# Altium project APP_1_rene0901.PrjPcb (part 2 of 2)

## Sheet APP_1_ADC.SchDoc
size Tabloid; SheetNumber: 11; SheetTotal: 11; Sheet_Name: ADC; Size: 11x17
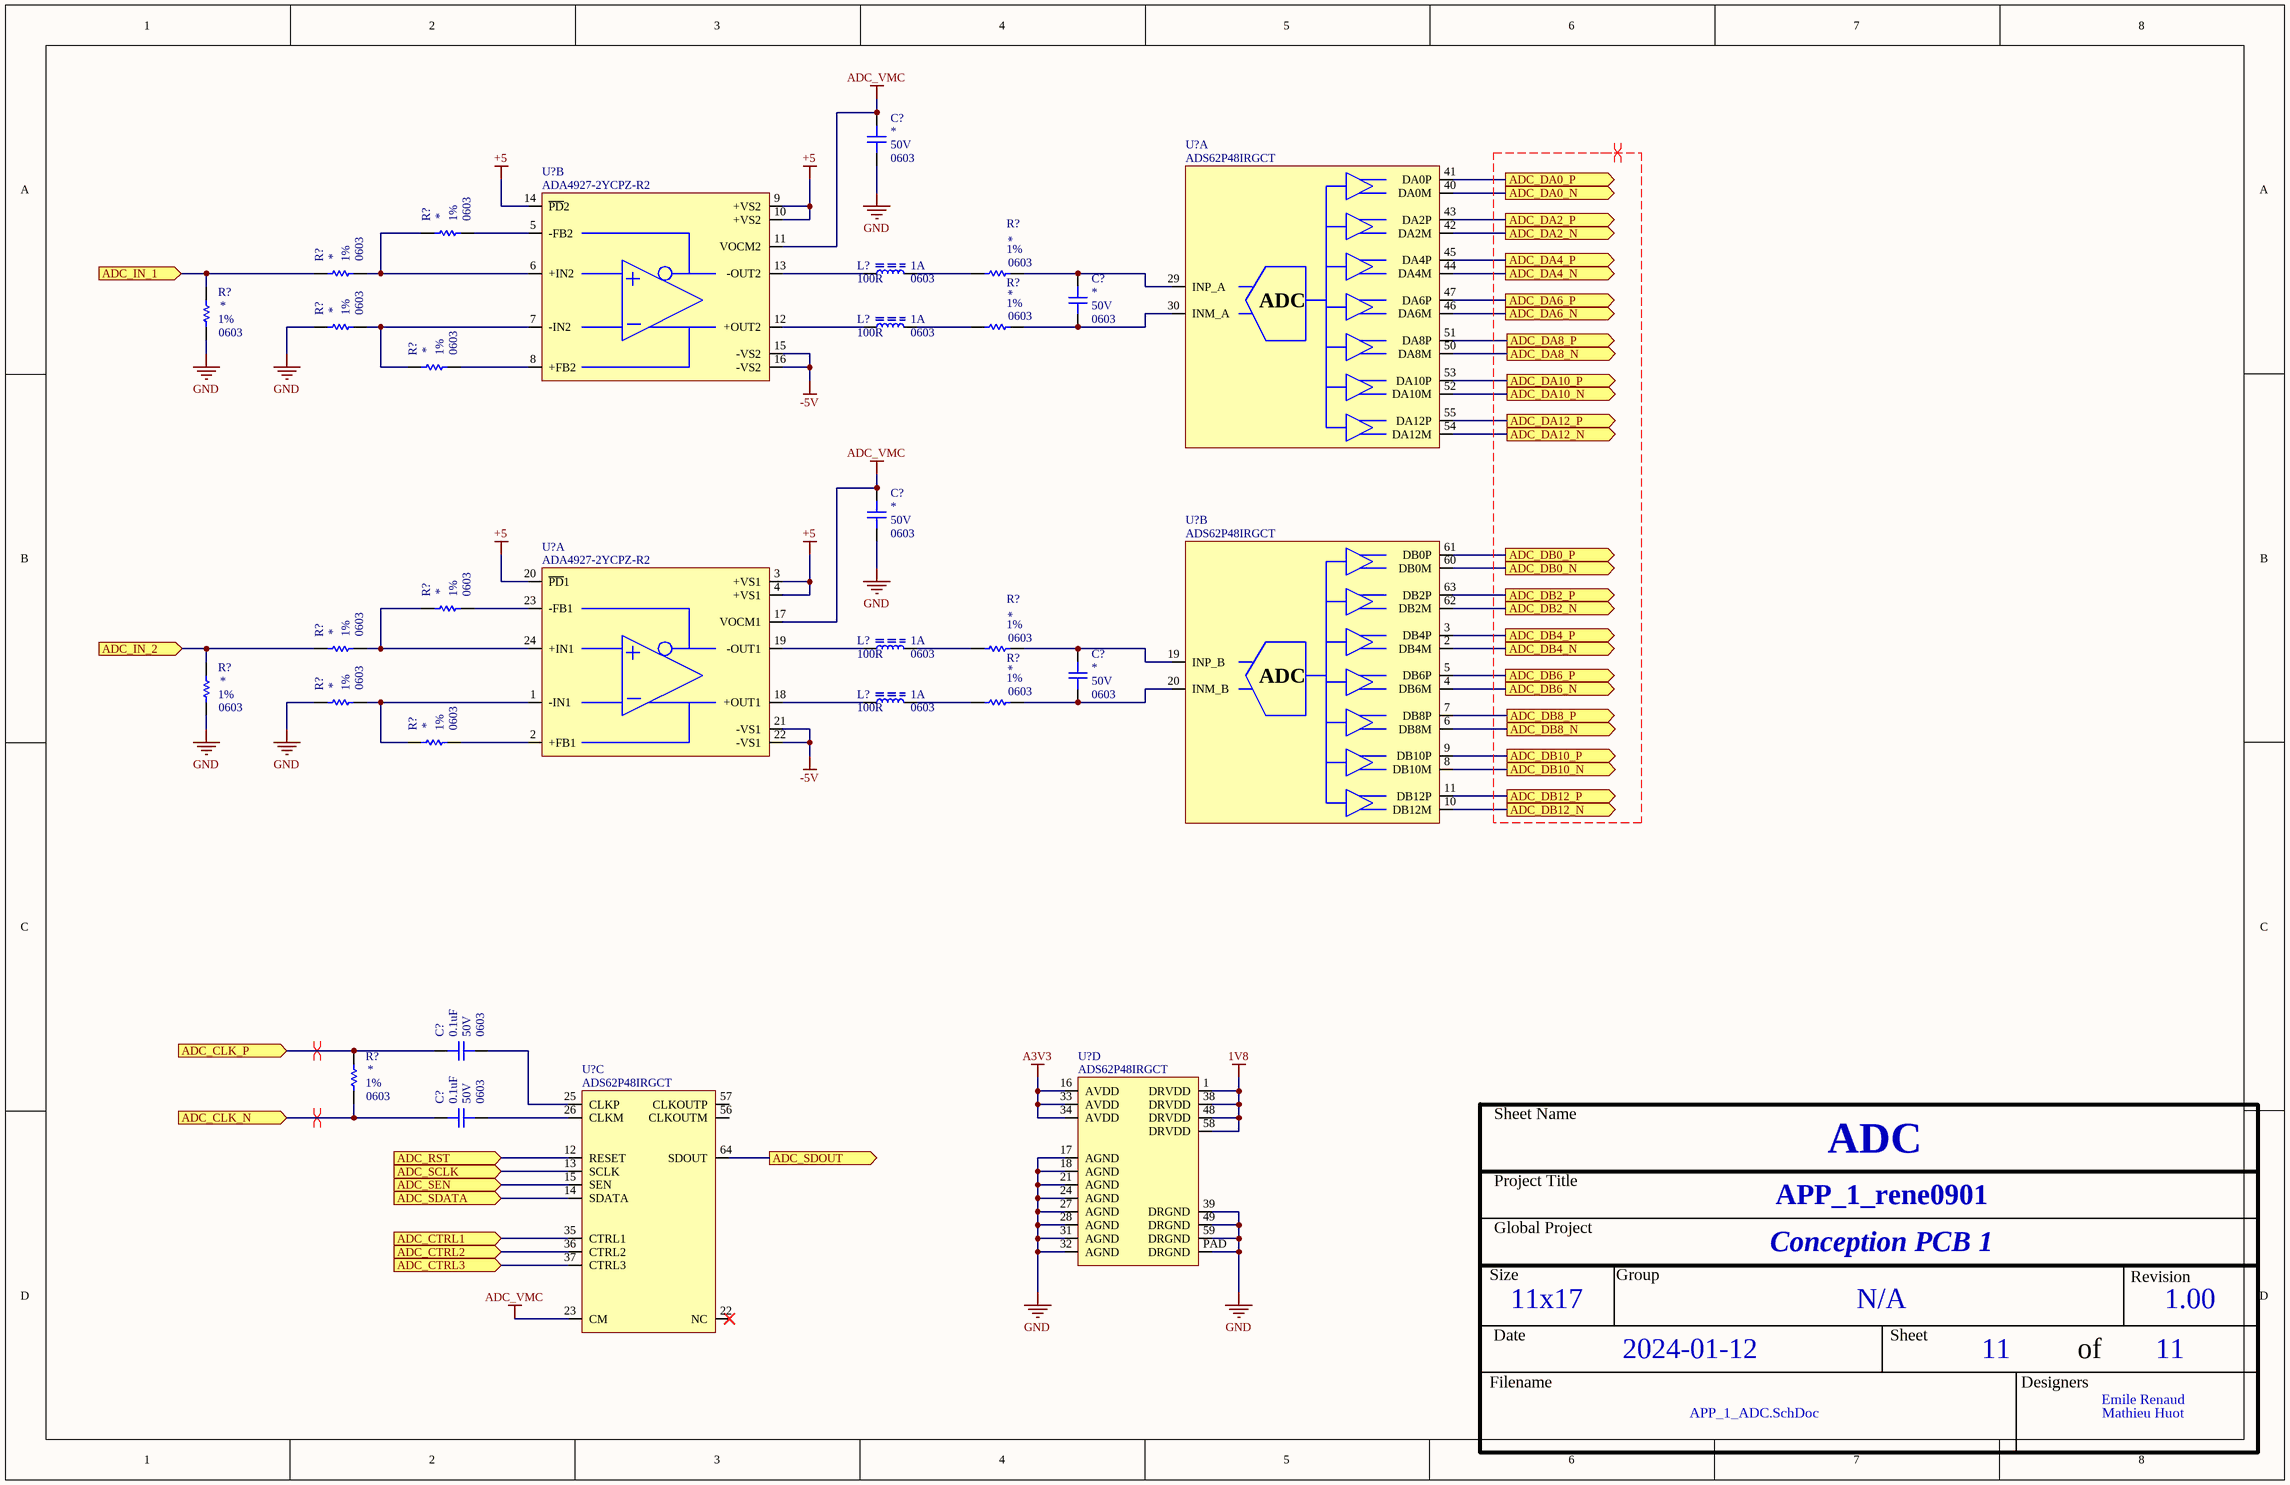
[diagram p7: APP_1_ADC.SchDoc]

### Parts
(Parts that share a designator on the sheet are numbered #1, #2 ... from top to bottom, then left to right.)
C?#43  Voltage: 50V  Package: 0603  [CAP_0603]  (hidden comment: CAP - 0603)
C?#44  Voltage: 50V  Package: 0603  [CAP_0603]  (hidden comment: CAP - 0603)
C?#45  Voltage: 50V  Package: 0603  [CAP_0603]  (hidden comment: CAP - 0603)
C?#46  Voltage: 50V  Package: 0603  [CAP_0603]  (hidden comment: CAP - 0603)
C?#47  value 0.1uF  Voltage: 50V  Package: 0603  [CAP_0603]  (hidden comment: CAP - 0603)
C?#48  value 0.1uF  Voltage: 50V  Package: 0603  [CAP_0603]  (hidden comment: CAP - 0603)
L?#6  value 100R  Current: 1A  Package: 0603  [FER_0603]  (hidden comment: FER - 0603)
L?#7  value 100R  Current: 1A  Package: 0603  [FER_0603]  (hidden comment: FER - 0603)
L?#8  value 100R  Current: 1A  Package: 0603  [FER_0603]  (hidden comment: FER - 0603)
L?#9  value 100R  Current: 1A  Package: 0603  [FER_0603]  (hidden comment: FER - 0603)
R?#62  Package: 0603  Precision: 1%  [RES_0603]  (hidden comment: RES - 0603)
R?#63  Package: 0603  Precision: 1%  [RES_0603]  (hidden comment: RES - 0603)
R?#64  Package: 0603  Precision: 1%  [RES_0603]  (hidden comment: RES - 0603)
R?#65  Package: 0603  Precision: 1%  [RES_0603]  (hidden comment: RES - 0603)
R?#66  Package: 0603  Precision: 1%  [RES_0603]  (hidden comment: RES - 0603)
R?#67  Package: 0603  Precision: 1%  [RES_0603]  (hidden comment: RES - 0603)
R?#68  Package: 0603  Precision: 1%  [RES_0603]  (hidden comment: RES - 0603)
R?#69  Package: 0603  Precision: 1%  [RES_0603]  (hidden comment: RES - 0603)
R?#70  Package: 0603  Precision: 1%  [RES_0603]  (hidden comment: RES - 0603)
R?#71  Package: 0603  Precision: 1%  [RES_0603]  (hidden comment: RES - 0603)
R?#72  Package: 0603  Precision: 1%  [RES_0603]  (hidden comment: RES - 0603)
R?#73  Package: 0603  Precision: 1%  [RES_0603]  (hidden comment: RES - 0603)
R?#74  Package: 0603  Precision: 1%  [RES_0603]  (hidden comment: RES - 0603)
R?#75  Package: 0603  Precision: 1%  [RES_0603]  (hidden comment: RES - 0603)
R?#76  Package: 0603  Precision: 1%  [RES_0603]  (hidden comment: RES - 0603)
U?#17  ADS62P48IRGCT  [ADC_ADS62P48IRGCT]  (part A of 4)
U?#18  ADA4927-2YCPZ-R2  [OPAMP_ADA4927-2YCPZ-R2]  (part B of 2)
U?#19  ADS62P48IRGCT  [ADC_ADS62P48IRGCT]  (part B of 4)
U?#20  ADA4927-2YCPZ-R2  [OPAMP_ADA4927-2YCPZ-R2]  (part A of 2)
U?#21  ADS62P48IRGCT  [ADC_ADS62P48IRGCT]  (part D of 4)
U?#22  ADS62P48IRGCT  [ADC_ADS62P48IRGCT]  (part C of 4)

### Ports
ADC_CLK_N (in), ADC_CLK_P (in), ADC_CTRL1 (in), ADC_CTRL2 (in), ADC_CTRL3 (in), ADC_DA0_N (out), ADC_DA0_P (out), ADC_DA2_N (out), ADC_DA2_P (out), ADC_DA4_N (out), ADC_DA4_P (out), ADC_DA6_N (out), ADC_DA6_P (out), ADC_DA8_N (out), ADC_DA8_P (out), ADC_DA10_N (out), ADC_DA10_P (out), ADC_DA12_N (out), ADC_DA12_P (out), ADC_DB0_N (out), ADC_DB0_P (out), ADC_DB2_N (out), ADC_DB2_P (out), ADC_DB4_N (out), ADC_DB4_P (out), ADC_DB6_N (out), ADC_DB6_P (out), ADC_DB8_N (out), ADC_DB8_P (out), ADC_DB10_N (out), ADC_DB10_P (out), ADC_DB12_N (out), ADC_DB12_P (out), ADC_IN_1 (in, see APP_1_Connectors_e[2C]), ADC_IN_2 (in, see APP_1_Connectors_e[2D]), ADC_RST (in), ADC_SCLK (in), ADC_SDATA (in), ADC_SDOUT (out), ADC_SEN (in)

### Nets
1V8: U?#21.1(DRVDD) U?#21.38(DRVDD) U?#21.48(DRVDD) U?#21.58(DRVDD)
+5: U?#18.9(+VS2) U?#18.10(+VS2) U?#18.14(~{PD}2) U?#20.3(+VS1) U?#20.4(+VS1) U?#20.20(~{PD}1)
-5V: U?#18.15(-VS2) U?#18.16(-VS2) U?#20.21(-VS1) U?#20.22(-VS1)
A3V3: U?#21.16(AVDD) U?#21.33(AVDD) U?#21.34(AVDD)
ADC_VMC: C?#43.2 C?#45.2 U?#18.11(VOCM2) U?#20.17(VOCM1) U?#22.23(CM)
GND: C?#43.1 C?#45.1 R?#65.1 R?#66.2 R?#72.1 R?#73.2 U?#21.17(AGND) U?#21.18(AGND) U?#21.21(AGND) U?#21.24(AGND) U?#21.27(AGND) U?#21.28(AGND) U?#21.31(AGND) U?#21.32(AGND) U?#21.39(DRGND) U?#21.49(DRGND) U?#21.59(DRGND) U?#21.PAD(DRGND)
ADC_CLK_N: C?#48.2 R?#76.1 ; port ADC_CLK_N
ADC_CLK_P: C?#47.2 R?#76.2 ; port ADC_CLK_P
ADC_CTRL1: U?#22.35(CTRL1) ; port ADC_CTRL1
ADC_CTRL2: U?#22.36(CTRL2) ; port ADC_CTRL2
ADC_CTRL3: U?#22.37(CTRL3) ; port ADC_CTRL3
ADC_DA0_N: U?#17.40(DA0M) ; port ADC_DA0_N
ADC_DA0_P: U?#17.41(DA0P) ; port ADC_DA0_P
ADC_DA2_N: U?#17.42(DA2M) ; port ADC_DA2_N
ADC_DA2_P: U?#17.43(DA2P) ; port ADC_DA2_P
ADC_DA4_N: U?#17.44(DA4M) ; port ADC_DA4_N
ADC_DA4_P: U?#17.45(DA4P) ; port ADC_DA4_P
ADC_DA6_N: U?#17.46(DA6M) ; port ADC_DA6_N
ADC_DA6_P: U?#17.47(DA6P) ; port ADC_DA6_P
ADC_DA8_N: U?#17.50(DA8M) ; port ADC_DA8_N
ADC_DA8_P: U?#17.51(DA8P) ; port ADC_DA8_P
ADC_DA10_N: U?#17.52(DA10M) ; port ADC_DA10_N
ADC_DA10_P: U?#17.53(DA10P) ; port ADC_DA10_P
ADC_DA12_N: U?#17.54(DA12M) ; port ADC_DA12_N
ADC_DA12_P: U?#17.55(DA12P) ; port ADC_DA12_P
ADC_DB0_N: U?#19.60(DB0M) ; port ADC_DB0_N
ADC_DB0_P: U?#19.61(DB0P) ; port ADC_DB0_P
ADC_DB2_N: U?#19.62(DB2M) ; port ADC_DB2_N
ADC_DB2_P: U?#19.63(DB2P) ; port ADC_DB2_P
ADC_DB4_N: U?#19.2(DB4M) ; port ADC_DB4_N
ADC_DB4_P: U?#19.3(DB4P) ; port ADC_DB4_P
ADC_DB6_N: U?#19.4(DB6M) ; port ADC_DB6_N
ADC_DB6_P: U?#19.5(DB6P) ; port ADC_DB6_P
ADC_DB8_N: U?#19.6(DB8M) ; port ADC_DB8_N
ADC_DB8_P: U?#19.7(DB8P) ; port ADC_DB8_P
ADC_DB10_N: U?#19.8(DB10M) ; port ADC_DB10_N
ADC_DB10_P: U?#19.9(DB10P) ; port ADC_DB10_P
ADC_DB12_N: U?#19.10(DB12M) ; port ADC_DB12_N
ADC_DB12_P: U?#19.11(DB12P) ; port ADC_DB12_P
ADC_IN_1: R?#63.2 R?#65.2 ; port ADC_IN_1
ADC_IN_2: R?#70.2 R?#72.2 ; port ADC_IN_2
ADC_RST: U?#22.12(RESET) ; port ADC_RST
ADC_SCLK: U?#22.13(SCLK) ; port ADC_SCLK
ADC_SDATA: U?#22.14(SDATA) ; port ADC_SDATA
ADC_SDOUT: U?#22.64(SDOUT) ; port ADC_SDOUT
ADC_SEN: U?#22.15(SEN) ; port ADC_SEN
NetC?#44_1: C?#44.1 R?#67.1 U?#17.30(INM_A)
NetC?#44_2: C?#44.2 R?#64.1 U?#17.29(INP_A)
NetC?#46_1: C?#46.1 R?#74.1 U?#19.20(INM_B)
NetC?#46_2: C?#46.2 R?#71.1 U?#19.19(INP_B)
NetC?#47_1: C?#47.1 U?#22.25(CLKP)
NetC?#48_1: C?#48.1 U?#22.26(CLKM)
NetL?#6_1: L?#6.1 R?#64.2
NetL?#6_2: L?#6.2 U?#18.13(-OUT2)
NetL?#7_1: L?#7.1 R?#67.2
NetL?#7_2: L?#7.2 U?#18.12(+OUT2)
NetL?#8_1: L?#8.1 R?#71.2
NetL?#8_2: L?#8.2 U?#20.19(-OUT1)
NetL?#9_1: L?#9.1 R?#74.2
NetL?#9_2: L?#9.2 U?#20.18(+OUT1)
NetR?#62_1: R?#62.1 U?#18.5(-FB2)
NetR?#62_2: R?#62.2 R?#63.1 U?#18.6(+IN2)
NetR?#66_1: R?#66.1 R?#68.2 U?#18.7(-IN2)
NetR?#68_1: R?#68.1 U?#18.8(+FB2)
NetR?#69_1: R?#69.1 U?#20.23(-FB1)
NetR?#69_2: R?#69.2 R?#70.1 U?#20.24(+IN1)
NetR?#73_1: R?#73.1 R?#75.2 U?#20.1(-IN1)
NetR?#75_1: R?#75.1 U?#20.2(+FB1)

Not connected (* = marked no-connect by the designer): U?#22 22(NC)* 56(CLKOUTM) 57(CLKOUTP)

### Layout directives
differential pair: (no net found under the mark), ADC_CLK_N, ADC_CLK_P

### Notes on the sheet
- Sheet Name
- Project Title
- Global Project
- Size
- Group
- Revision
- Date
- Sheet
- of
- Filename
- Designers
- (in symbol ADC_ADS62P48IRGCT, part A) ADC
- (in symbol ADC_ADS62P48IRGCT, part B) ADC

### Library data of the parts
C?#43-C?#48 = CAP - 0603: Precision: 10%; Current: *; CreatedBy: Jonathan Bouchard; Power: *
  C?#43-C?#46: Value: *
U?#17 U?#19 U?#21 U?#22 = ADC_ADS62P48IRGCT: ADC - 14 BIT 210MSPS SUAL - VQFN-64; Voltage: 3.15 V ~ 3.6 V / 1.7 V ~ 1.9 V; Mfg: Texas Instruments; Precision: 14 Bit; Current: *; Power: *; Mfg Part Number: ADS62P48IRGCT; HelpURL: http://www.ti.com/lit/ds/symlink/ads62p48.pdf; CreatedBy: Jonathan Bouchard; Temperature: -40°C ~ 85°C; Value: *; Package: VQFN-64; Supplier 1: Digikey; Supplier Part Number 1: 296-24611-1-ND
U?#18 U?#20 = OPAMP_ADA4927-2YCPZ-R2: OPAMP - CFA 2.3GHZ - QFN-24; Voltage: 4.5 V ~ 11 V, ±2.25 V ~ 5.5 V; Current: 65mA; Mfg: Analog Devices; Power: *; Mfg Part Number: ADA4927-2YCPZ-R2; HelpURL: http://www.analog.com/media/en/technical-documentation/data-sheets/ADA4927-1_4927-2.pdf; CreatedBy: Jonathan Bouchard; Temperature: -40°C ~ 105°C; Value: *; Precision: *; Package: QFN-24; Supplier 1: Digikey; Supplier Part Number 1: ADA4927-2YCPZ-R2CT-ND
L?#6-L?#9 = FER - 0603: Voltage: *; CreatedBy: Jonathan Bouchard; Power: *; Precision: *
R?#62-R?#76 = RES - 0603: Current: *; CreatedBy: Jonathan Bouchard; Value: *

## Sheet APP_1_Ethernet.SchDoc
size Tabloid; SheetNumber: 10; SheetTotal: 13; Sheet_Name: Ethernet; Size: 11x17
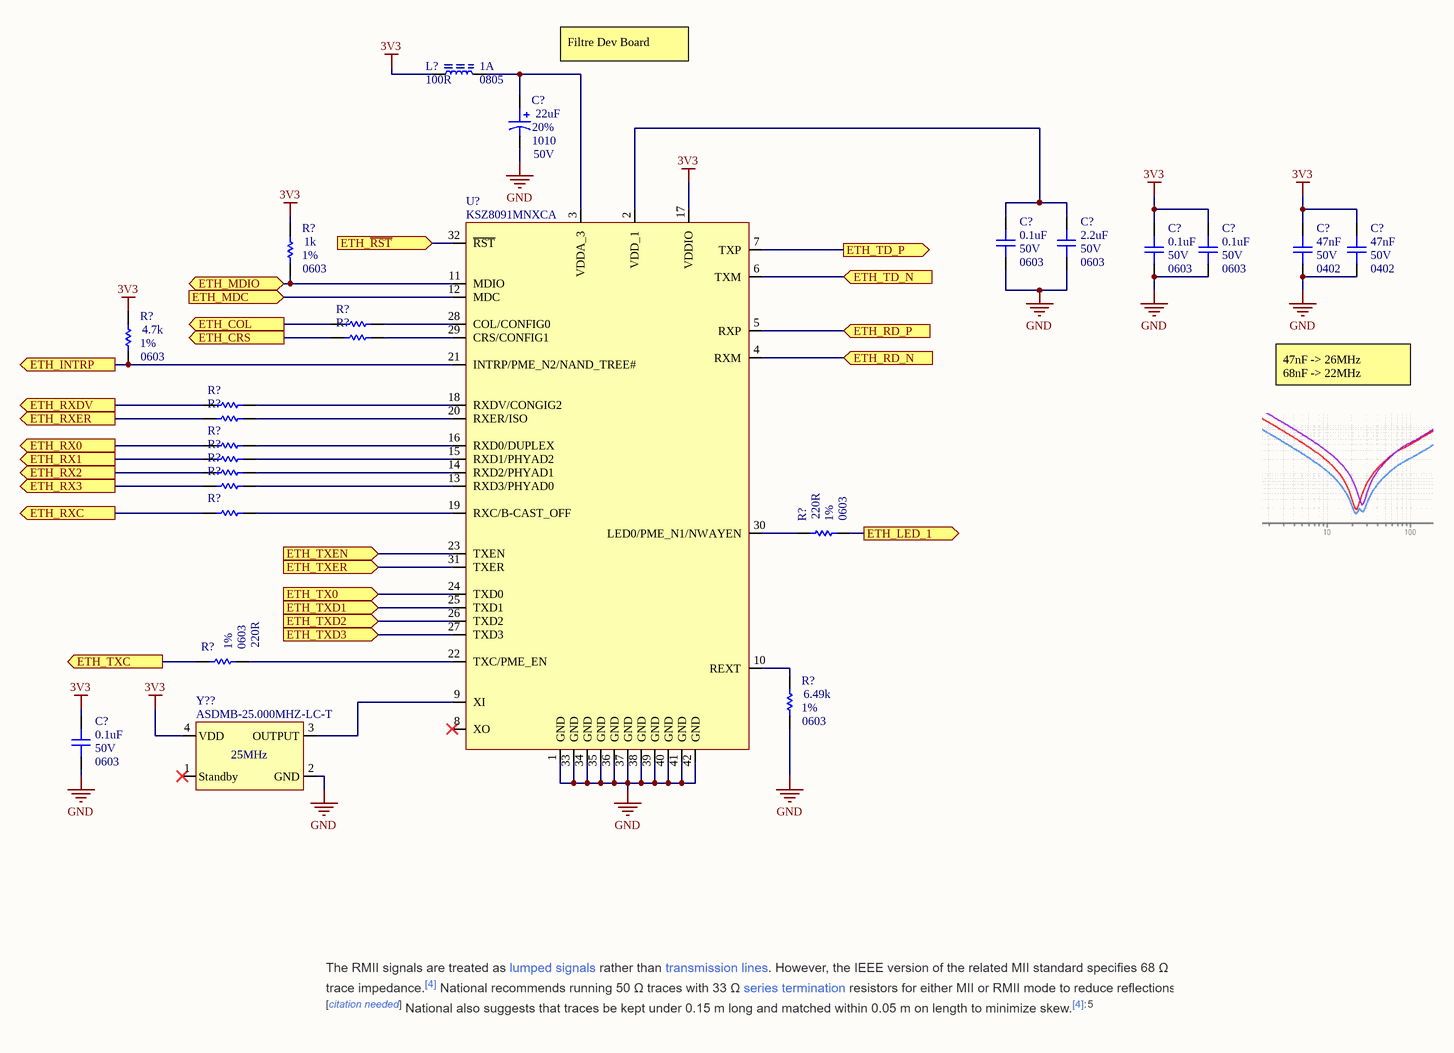
[diagram p8: APP_1_Ethernet.SchDoc]

### Parts
(Parts that share a designator on the sheet are numbered #1, #2 ... from top to bottom, then left to right.)
C?#49  value 22uF  Voltage: 50V  Package: 1010  Precision: 20%  [CAP_ALU_1010_vishay]  (hidden comment: MAL215099101E3)
C?#50  value 0.1uF  Voltage: 50V  Package: 0603  [CAP_0603]  (hidden comment: CAP - 0603)
C?#51  value 2.2uF  Voltage: 50V  Package: 0603  [CAP_0603]  (hidden comment: CAP - 0603)
C?#52  value 0.1uF  Voltage: 50V  Package: 0603  [CAP_0603]  (hidden comment: CAP - 0603)
C?#53  value 0.1uF  Voltage: 50V  Package: 0603  [CAP_0603]  (hidden comment: CAP - 0603)
C?#54  value 47nF  Voltage: 50V  Package: 0402  [CAP_0402]  (hidden comment: CAP - 0402)
C?#55  value 47nF  Voltage: 50V  Package: 0402  [CAP_0402]  (hidden comment: CAP - 0402)
C?#56  value 0.1uF  Voltage: 50V  Package: 0603  [CAP_0603]  (hidden comment: CAP - 0603)
L?#10  value 100R  Current: 1A  Package: 0805  [FER_0805]  (hidden comment: FER - 0805)
R?#77  value 1k  Package: 0603  Precision: 1%  [RES_0603]  (hidden comment: RES - 0603)
R?#78  RES - 0603  [RES_0603]  (value not drawn)
R?#79  value 4.7k  Package: 0603  Precision: 1%  [RES_0603]  (hidden comment: RES - 0603)
R?#80  RES - 0603  [RES_0603]  (value not drawn)
R?#81  RES - 0603  [RES_0603]  (value not drawn)
R?#82  RES - 0603  [RES_0603]  (value not drawn)
R?#83  RES - 0603  [RES_0603]  (value not drawn)
R?#84  RES - 0603  [RES_0603]  (value not drawn)
R?#85  RES - 0603  [RES_0603]  (value not drawn)
R?#86  RES - 0603  [RES_0603]  (value not drawn)
R?#87  RES - 0603  [RES_0603]  (value not drawn)
R?#88  value 220R  Package: 0603  Precision: 1%  [RES_0603]  (hidden comment: RES - 0603)
R?#89  value 220R  Package: 0603  Precision: 1%  [RES_0603]  (hidden comment: RES - 0603)
R?#90  value 6.49k  Package: 0603  Precision: 1%  [RES_0603]  (hidden comment: RES - 0603)
U?#23  KSZ8091MNXCA  [COM_ETH_PHY_KSZ8091MNXCA]
Y??#1  ASDMB-25.000MHZ-LC-T  [OSC_ASDMB-25.000MHZ-LC-T]

### Ports
ETH_COL (out), ETH_CRS (out), ETH_INTRP (out), ETH_LED_1 (out, see APP_1_Connectors_e[4B]), ETH_MDC (in), ETH_MDIO (bidir), ETH_RD_N (in, see APP_1_Connectors_e[5B]), ETH_RD_P (in, see APP_1_Connectors_e[5B]), ETH_RX0 (out), ETH_RX1 (out), ETH_RX2 (out), ETH_RX3 (out), ETH_RXC (out), ETH_RXDV (out), ETH_RXER (out), ETH_TD_N (in, see APP_1_Connectors_e[6B]), ETH_TD_P (out, see APP_1_Connectors_e[6B]), ETH_TX0 (in), ETH_TXC (out), ETH_TXD1 (in), ETH_TXD2 (in), ETH_TXD3 (in), ETH_TXEN (in), ETH_TXER (in), ETH_~{RST} (in)

### Nets
3V3: C?#52.2 C?#53.2 C?#54.2 C?#55.2 C?#56.2 L?#10.2 R?#77.2 R?#79.2 U?#23.17(VDDIO) Y??#1.4(VDD)
GND: C?#49.2 C?#50.1 C?#51.1 C?#52.1 C?#53.1 C?#54.1 C?#55.1 C?#56.1 R?#90.1 U?#23.1(GND) U?#23.33(GND) U?#23.34(GND) U?#23.35(GND) U?#23.36(GND) U?#23.37(GND) U?#23.38(GND) U?#23.39(GND) U?#23.40(GND) U?#23.41(GND) U?#23.42(GND) Y??#1.2(GND)
ETH_COL: R?#78.2 ; port ETH_COL
ETH_CRS: R?#80.2 ; port ETH_CRS
ETH_INTRP: R?#79.1 U?#23.21(INTRP/PME_N2/NAND_TREE#) ; port ETH_INTRP
ETH_LED_1: R?#88.1 ; port ETH_LED_1
ETH_MDC: U?#23.12(MDC) ; port ETH_MDC
ETH_MDIO: R?#77.1 U?#23.11(MDIO) ; port ETH_MDIO
ETH_~{RST}: U?#23.32(~{RST}) ; port ETH_~{RST}
ETH_RD_N: U?#23.4(RXM) ; port ETH_RD_N
ETH_RD_P: U?#23.5(RXP) ; port ETH_RD_P
ETH_RX0: R?#83.2 ; port ETH_RX0
ETH_RX1: R?#84.2 ; port ETH_RX1
ETH_RX2: R?#85.2 ; port ETH_RX2
ETH_RX3: R?#86.2 ; port ETH_RX3
ETH_RXC: R?#87.2 ; port ETH_RXC
ETH_RXDV: R?#81.2 ; port ETH_RXDV
ETH_RXER: R?#82.2 ; port ETH_RXER
ETH_TD_N: U?#23.6(TXM) ; port ETH_TD_N
ETH_TD_P: U?#23.7(TXP) ; port ETH_TD_P
ETH_TX0: U?#23.24(TXD0) ; port ETH_TX0
ETH_TXC: R?#89.2 ; port ETH_TXC
ETH_TXD1: U?#23.25(TXD1) ; port ETH_TXD1
ETH_TXD2: U?#23.26(TXD2) ; port ETH_TXD2
ETH_TXD3: U?#23.27(TXD3) ; port ETH_TXD3
ETH_TXEN: U?#23.23(TXEN) ; port ETH_TXEN
ETH_TXER: U?#23.31(TXER) ; port ETH_TXER
NetC?#49_1: C?#49.1 L?#10.1 U?#23.3(VDDA_3)
NetC?#50_2: C?#50.2 C?#51.2 U?#23.2(VDD_1)
NetR?#78_1: R?#78.1 U?#23.28(COL/CONFIG0)
NetR?#80_1: R?#80.1 U?#23.29(CRS/CONFIG1)
NetR?#81_1: R?#81.1 U?#23.18(RXDV/CONGIG2)
NetR?#82_1: R?#82.1 U?#23.20(RXER/ISO)
NetR?#83_1: R?#83.1 U?#23.16(RXD0/DUPLEX)
NetR?#84_1: R?#84.1 U?#23.15(RXD1/PHYAD2)
NetR?#85_1: R?#85.1 U?#23.14(RXD2/PHYAD1)
NetR?#86_1: R?#86.1 U?#23.13(RXD3/PHYAD0)
NetR?#87_1: R?#87.1 U?#23.19(RXC/B-CAST_OFF)
NetR?#88_2: R?#88.2 U?#23.30(LED0/PME_N1/NWAYEN)
NetR?#89_1: R?#89.1 U?#23.22(TXC/PME_EN)
NetR?#90_2: R?#90.2 U?#23.10(REXT)
NetU?#23_9: U?#23.9(XI) Y??#1.3(OUTPUT)

Not connected (* = marked no-connect by the designer): U?#23 8(XO)*; Y??#1 1(Standby)*

### Notes on the sheet
- Filtre Dev Board
- 47nF -> 26MHz
  68nF -> 22MHz
- Sheet Name
- Project Title
- Global Project
- Size
- Group
- Revision
- Date
- Sheet
- of
- Filename
- Designers

### Library data of the parts
C?#49 = CAP_ALU_MAL215099101E3: CAP - ALU 100uF 20% 50V - 1010; Current: 490mA; Mfg: Vishay Dale; Mfg Part Number: MAL215099101E3; HelpURL: http://www.vishay.com/docs/28395/150crz.pdf; CreatedBy: Jonathan Bouchard; Temperature: -55°C to 125°C; Power: *; Supplier 1: Digikey; Supplier Part Number 1: 4399PHDKR-ND
C?#50-C?#53 C?#56 = CAP - 0603: Precision: 10%; Current: *; CreatedBy: Jonathan Bouchard; Power: *
C?#54 C?#55 = CAP - 0402: Precision: 10%; Current: *; CreatedBy: Jonathan Bouchard; Power: *
R?#78 R?#80-R?#87 = RES - 0603: Precision: 1%; Value: 220R; Current: *; CreatedBy: Jonathan Bouchard; Package: 0603
U?#23 = COM_ETH_PHY_KSZ8091MNXCA: COM - ETHERNET PHY 10/100 - QFN-32; Voltage: 1.8V, 2.5V, 3.3V; Mfg: Micrel; Current: *; Power: *; Mfg Part Number: KSZ8091MNXCA; HelpURL: http://ww1.microchip.com/downloads/en/DeviceDoc/00002275A.pdf; CreatedBy: Jonathan Bouchard; Temperature: 0°C ~ 70°C; Value: *; Precision: *; Package: QFN-32; Supplier 1: Digikey; Supplier Part Number 1: 576-4356-ND
Y??#1 = OSC_ASDMB-25.000MHZ-LC-T: OSC - 25MHz XO (Standard) LVCMOS - 4-SMD, No Lead; Manufacturer #1: Abracon LLC; Tolerance: ±50ppm; Voltage Rating: 1.8V ~ 3.3V; GRAMS Lib Spec: 2.8; Magnetic Material: Unknown; Polarized: Yes; Value: 25MHz; Current Rating: *; Power Max: *; HelpURL: https://abracon.com/Oscillators/ASDMB.pdf; CreatedBy/Date: Joël Lemay 2019-03-29; VerifiedBy: C. Paulin - 29 mai 2019; Temperature: -40°C ~ +85°C; Package: 4-SMD, No Lead; Manufacturer #2: *; Note: *; Assembly Type: SMD; Part Number #2: *; Part Number #1: ASDMB-25.000MHZ-LC-T; Supplier 1: Digi-Key; Supplier Part Number 1: 535-11730-1-ND; Cryo: UNKNOWN
L?#10 = FER - 0805: Voltage: *; CreatedBy: Jonathan Bouchard; Power: *; Precision: *
R?#77 R?#79 R?#88-R?#90 = RES - 0603: Current: *; CreatedBy: Jonathan Bouchard

## Sheet APP_1_Power.SchDoc
size Tabloid; SheetNumber: 11; SheetTotal: 13; Sheet_Name: Power; Size: 11x17
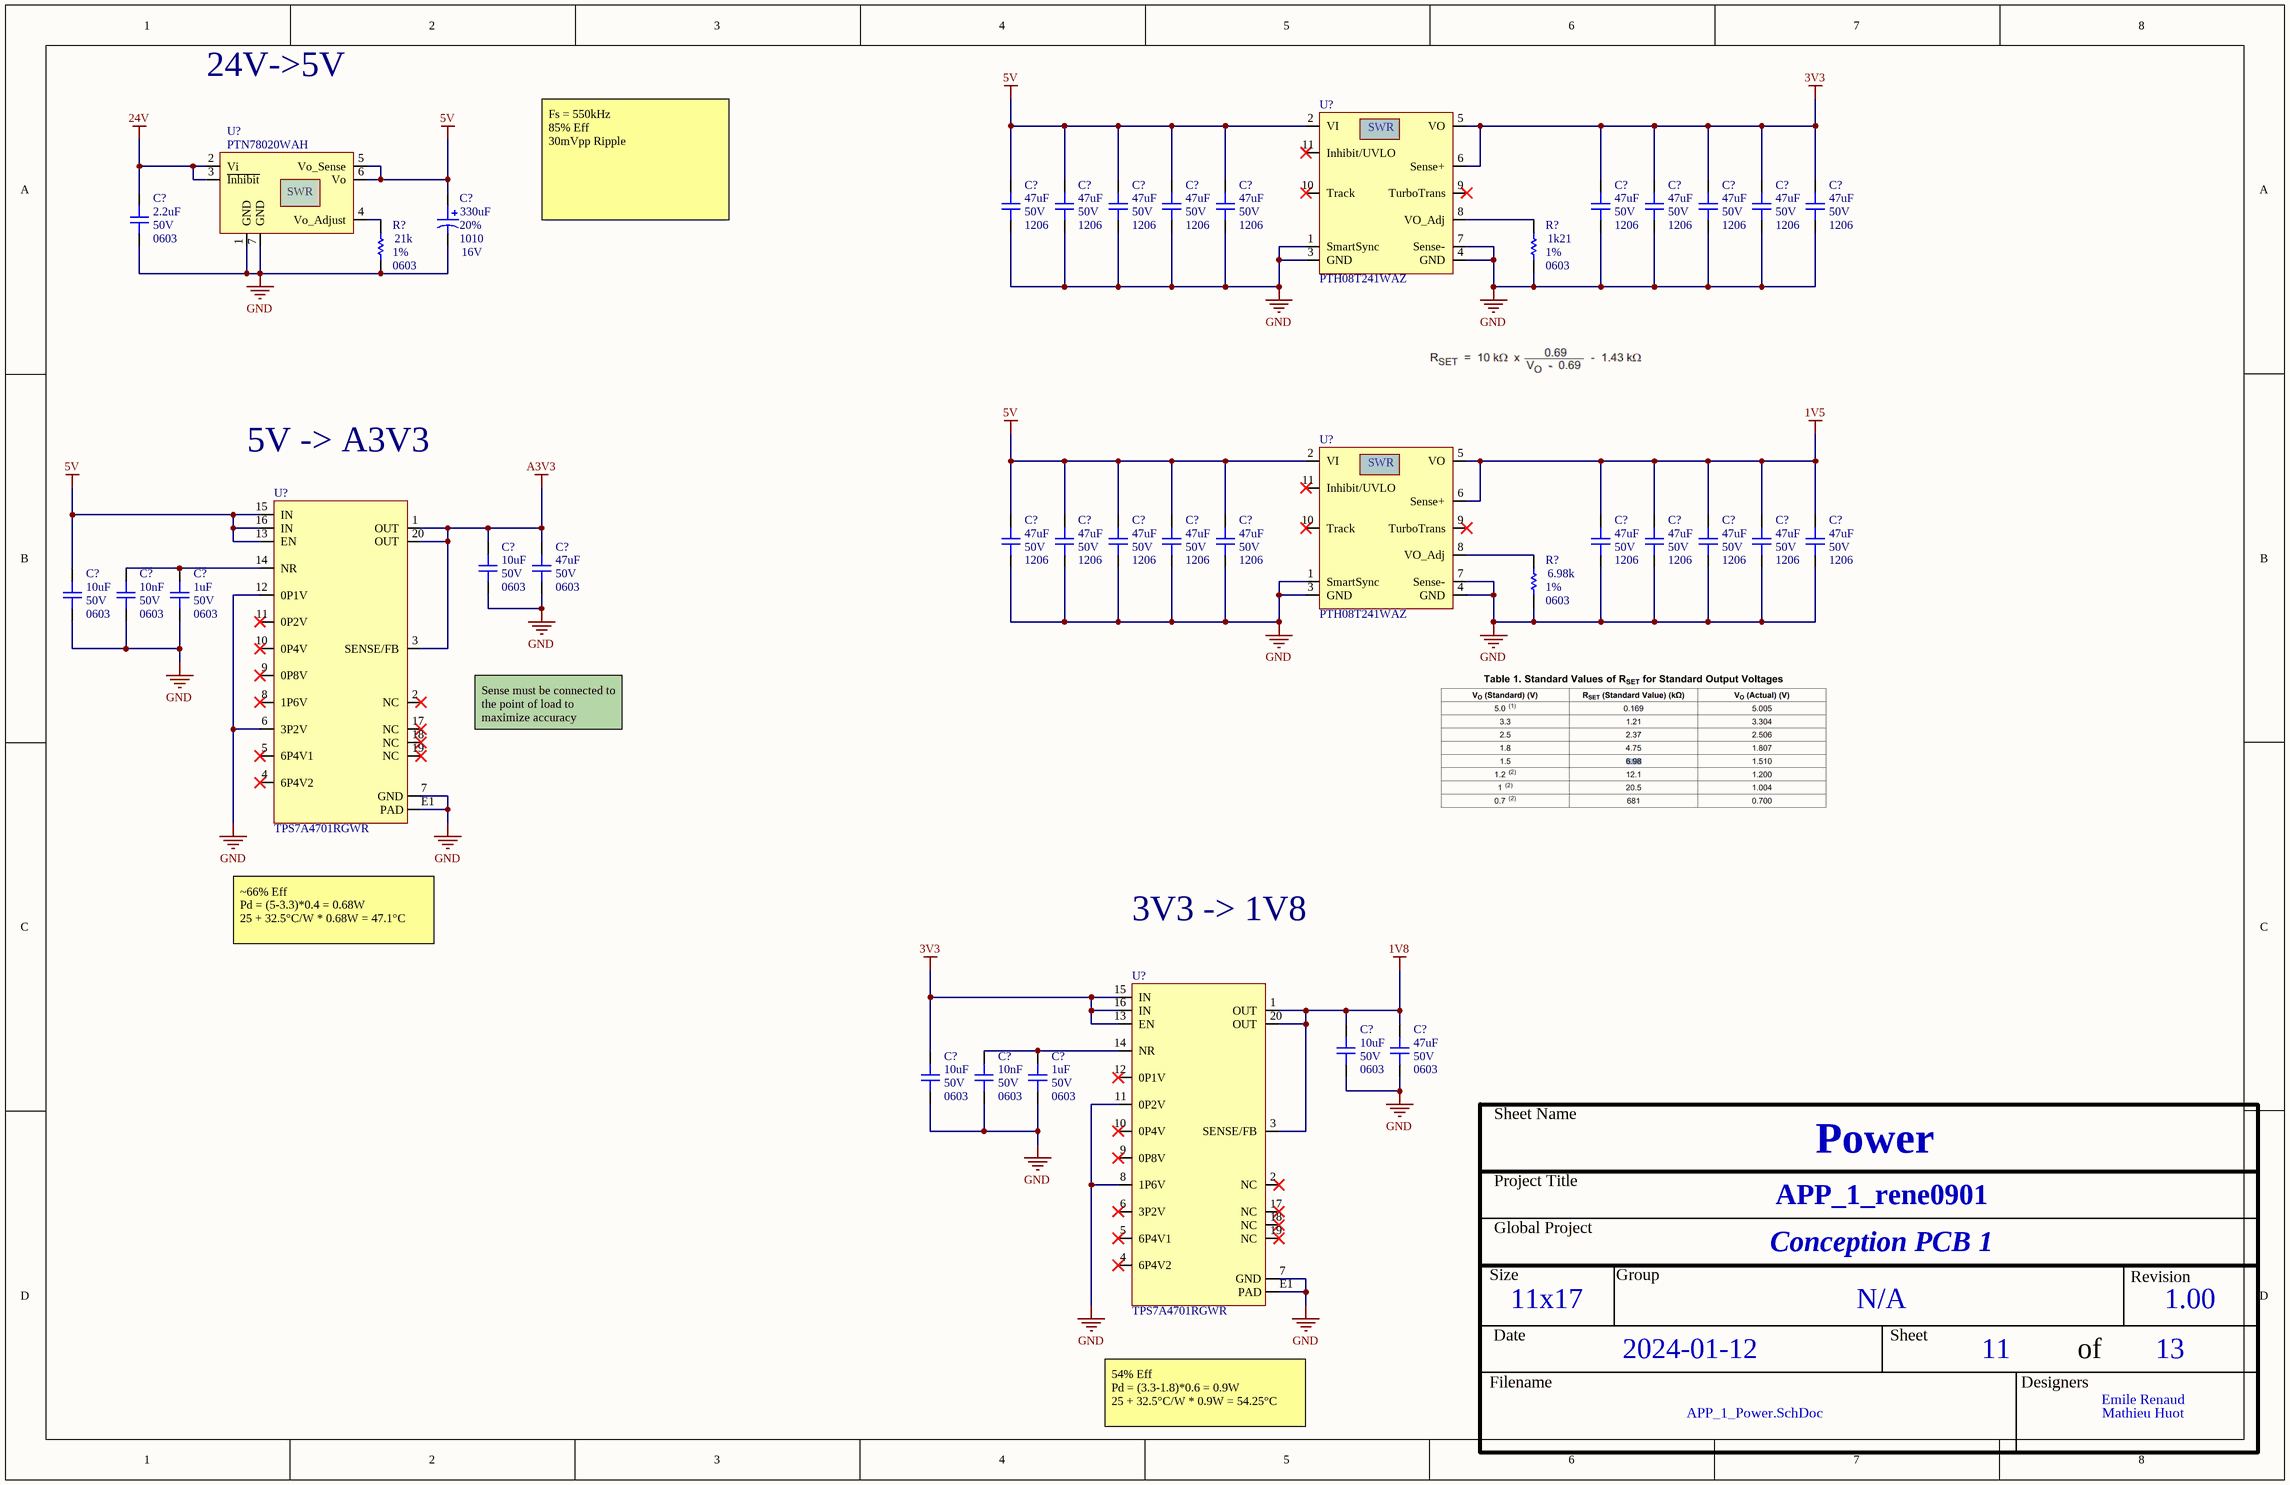
[diagram p9: APP_1_Power.SchDoc]

### Parts
(Parts that share a designator on the sheet are numbered #1, #2 ... from top to bottom, then left to right.)
C?#57  value 47uF  Voltage: 50V  Package: 1206  [CAP_1206]  (hidden comment: CAP - 1206)
C?#58  value 47uF  Voltage: 50V  Package: 1206  [CAP_1206]  (hidden comment: CAP - 1206)
C?#59  value 47uF  Voltage: 50V  Package: 1206  [CAP_1206]  (hidden comment: CAP - 1206)
C?#60  value 47uF  Voltage: 50V  Package: 1206  [CAP_1206]  (hidden comment: CAP - 1206)
C?#61  value 47uF  Voltage: 50V  Package: 1206  [CAP_1206]  (hidden comment: CAP - 1206)
C?#62  value 47uF  Voltage: 50V  Package: 1206  [CAP_1206]  (hidden comment: CAP - 1206)
C?#63  value 47uF  Voltage: 50V  Package: 1206  [CAP_1206]  (hidden comment: CAP - 1206)
C?#64  value 47uF  Voltage: 50V  Package: 1206  [CAP_1206]  (hidden comment: CAP - 1206)
C?#65  value 47uF  Voltage: 50V  Package: 1206  [CAP_1206]  (hidden comment: CAP - 1206)
C?#66  value 47uF  Voltage: 50V  Package: 1206  [CAP_1206]  (hidden comment: CAP - 1206)
C?#67  value 2.2uF  Voltage: 50V  Package: 0603  [CAP_0603]  (hidden comment: CAP - 0603)
C?#68  value 330uF  Voltage: 16V  Package: 1010  Precision: 20%  [CAP_ALU_1010_vishay]  (hidden comment: MAL214699501E3)
C?#69  value 47uF  Voltage: 50V  Package: 1206  [CAP_1206]  (hidden comment: CAP - 1206)
C?#70  value 47uF  Voltage: 50V  Package: 1206  [CAP_1206]  (hidden comment: CAP - 1206)
C?#71  value 47uF  Voltage: 50V  Package: 1206  [CAP_1206]  (hidden comment: CAP - 1206)
C?#72  value 47uF  Voltage: 50V  Package: 1206  [CAP_1206]  (hidden comment: CAP - 1206)
C?#73  value 47uF  Voltage: 50V  Package: 1206  [CAP_1206]  (hidden comment: CAP - 1206)
C?#74  value 47uF  Voltage: 50V  Package: 1206  [CAP_1206]  (hidden comment: CAP - 1206)
C?#75  value 47uF  Voltage: 50V  Package: 1206  [CAP_1206]  (hidden comment: CAP - 1206)
C?#76  value 47uF  Voltage: 50V  Package: 1206  [CAP_1206]  (hidden comment: CAP - 1206)
C?#77  value 47uF  Voltage: 50V  Package: 1206  [CAP_1206]  (hidden comment: CAP - 1206)
C?#78  value 47uF  Voltage: 50V  Package: 1206  [CAP_1206]  (hidden comment: CAP - 1206)
C?#79  value 10uF  Voltage: 50V  Package: 0603  [CAP_0603]  (hidden comment: CAP - 0603)
C?#80  value 47uF  Voltage: 50V  Package: 0603  [CAP_0603]  (hidden comment: CAP - 0603)
C?#81  value 10uF  Voltage: 50V  Package: 0603  [CAP_0603]  (hidden comment: CAP - 0603)
C?#82  value 10nF  Voltage: 50V  Package: 0603  [CAP_0603]  (hidden comment: CAP - 0603)
C?#83  value 1uF  Voltage: 50V  Package: 0603  [CAP_0603]  (hidden comment: CAP - 0603)
C?#84  value 10uF  Voltage: 50V  Package: 0603  [CAP_0603]  (hidden comment: CAP - 0603)
C?#85  value 47uF  Voltage: 50V  Package: 0603  [CAP_0603]  (hidden comment: CAP - 0603)
C?#86  value 10uF  Voltage: 50V  Package: 0603  [CAP_0603]  (hidden comment: CAP - 0603)
C?#87  value 10nF  Voltage: 50V  Package: 0603  [CAP_0603]  (hidden comment: CAP - 0603)
C?#88  value 1uF  Voltage: 50V  Package: 0603  [CAP_0603]  (hidden comment: CAP - 0603)
R?#91  value 21k  Package: 0603  Precision: 1%  [RES_0603]  (hidden comment: RES - 0603)
R?#92  value 1k21  Package: 0603  Precision: 1%  [RES_0603]  (hidden comment: RES - 0603)
R?#93  value 6.98k  Package: 0603  Precision: 1%  [RES_0603]  (hidden comment: RES - 0603)
U?#24  PTH08T241WAZ  [REG_SWR_PTH08T241WAZ]
U?#25  PTN78020WAH  [REG_SWR_PTN78020WAH]
U?#26  PTH08T241WAZ  [REG_SWR_PTH08T241WAZ]
U?#27  TPS7A4701RGWR  [REG_TPS7A4701RGWR]
U?#28  TPS7A4701RGWR  [REG_TPS7A4701RGWR]

### Nets
1V5: C?#74.2 C?#75.2 C?#76.2 C?#77.2 C?#78.2 U?#26.5(VO) U?#26.6(Sense+)
1V8: C?#84.2 C?#85.2 U?#28.1(OUT) U?#28.3(SENSE/FB) U?#28.20(OUT)
3V3: C?#62.2 C?#63.2 C?#64.2 C?#65.2 C?#66.2 C?#86.2 U?#24.5(VO) U?#24.6(Sense+) U?#28.13(EN) U?#28.15(IN) U?#28.16(IN)
5V: C?#57.2 C?#58.2 C?#59.2 C?#60.2 C?#61.2 C?#68.1 C?#69.2 C?#70.2 C?#71.2 C?#72.2 C?#73.2 C?#81.2 U?#24.2(VI) U?#25.5(Vo_Sense) U?#25.6(Vo) U?#26.2(VI) U?#27.13(EN) U?#27.15(IN) U?#27.16(IN)
24V: C?#67.2 U?#25.2(Vi) U?#25.3(~{Inhibit})
A3V3: C?#79.2 C?#80.2 U?#27.1(OUT) U?#27.3(SENSE/FB) U?#27.20(OUT)
GND: C?#57.1 C?#58.1 C?#59.1 C?#60.1 C?#61.1 C?#62.1 C?#63.1 C?#64.1 C?#65.1 C?#66.1 C?#67.1 C?#68.2 C?#69.1 C?#70.1 C?#71.1 C?#72.1 C?#73.1 C?#74.1 C?#75.1 C?#76.1 C?#77.1 C?#78.1 C?#79.1 C?#80.1 C?#81.1 C?#82.1 C?#83.1 C?#84.1 C?#85.1 C?#86.1 C?#87.1 C?#88.1 R?#91.1 R?#92.1 R?#93.1 U?#24.1(SmartSync) U?#24.3(GND) U?#24.4(GND) U?#24.7(Sense-) U?#25.1(GND) U?#25.7(GND) U?#26.1(SmartSync) U?#26.3(GND) U?#26.4(GND) U?#26.7(Sense-) U?#27.6(3P2V) U?#27.7(GND) U?#27.12(0P1V) U?#27.E1(PAD) U?#28.7(GND) U?#28.8(1P6V) U?#28.11(0P2V) U?#28.E1(PAD)
NetC?#82_2: C?#82.2 C?#83.2 U?#27.14(NR)
NetC?#87_2: C?#87.2 C?#88.2 U?#28.14(NR)
NetR?#91_2: R?#91.2 U?#25.4(Vo_Adjust)
NetR?#92_2: R?#92.2 U?#24.8(VO_Adj)
NetR?#93_2: R?#93.2 U?#26.8(VO_Adj)

Not connected (* = marked no-connect by the designer): U?#24 9(TurboTrans)* 10(Track)* 11(Inhibit/UVLO)*; U?#26 9(TurboTrans)* 10(Track)* 11(Inhibit/UVLO)*; U?#27 2(NC)* 4(6P4V2)* 5(6P4V1)* 8(1P6V)* 9(0P8V)* 10(0P4V)* 11(0P2V)* 17(NC)* 18(NC)* 19(NC)*; U?#28 2(NC)* 4(6P4V2)* 5(6P4V1)* 6(3P2V)* 9(0P8V)* 10(0P4V)* 12(0P1V)* 17(NC)* 18(NC)* 19(NC)*

### Notes on the sheet
- 24V->5V
- Fs = 550kHz
  85% Eff
  30mVpp Ripple
- 5V -> A3V3
- Sense must be connected to the point of load to maximize accuracy
- ~66% Eff
  Pd = (5-3.3)*0.4 = 0.68W
  25 + 32.5°C/W * 0.68W = 47.1°C
- 3V3 -> 1V8
- 54% Eff
  Pd = (3.3-1.8)*0.6 = 0.9W
  25 + 32.5°C/W * 0.9W = 54.25°C
- Sheet Name
- Project Title
- Global Project
- Size
- Group
- Revision
- Date
- Sheet
- of
- Filename
- Designers
- (in symbol REG_SWR_PTH08T241WAZ) SWR
- (in symbol REG_SWR_PTN78020WAH) SWR

### Library data of the parts
C?#57-C?#66 C?#69-C?#78 = CAP - 1206: Precision: 10%; Current: *; CreatedBy: Jonathan Bouchard; Power: *
C?#67 C?#79-C?#88 = CAP - 0603: Precision: 10%; Current: *; CreatedBy: Jonathan Bouchard; Power: *
C?#68 = CAP_ALU_MAL214699501E3: CAP - ALU 330uF 20% 16V - 1010; Current: 750mA; Mfg: Vishay Dale; Mfg Part Number: MAL214699501E3; HelpURL: http://www.vishay.com/docs/28403/146cti.pdf; CreatedBy: Jonathan Bouchard; Temperature: -55°C to 125°C; Power: *; Supplier 1: Digikey; Supplier Part Number 1: 4405PHCT-ND
U?#24 U?#26 = REG_SWR_PTH08T241WAZ: REG - MODULE PIP 10A 14VIN - 11-SMD; Manufacturer #1: Texas Instruments; Current Rating: 10A (out); Voltage rating: 4.5-14V (Input), 0.69 - 5.5V (Out); Polarized: Yes; Magnetic Material: UNKNOWN; Manufacturer #2: *; Note: *; Power Max: *; Value: *; Part Number #1: PTH08T241WAZ; Part Number #2: *; HelpURL: http://www.ti.com/lit/ds/symlink/pth08t241w.pdf; Supplier 1: Digi-Key; Supplier Part Number 1: 296-21339-ND; Assembly Type: SMD; Temperature: -40°C ~ 85°C; Package: SMD; CreatedBy/Date: Olivier Bernard / 6/5/2018; VerifiedBy: Caroline Paulin / 10 juillet 2018; Cryo: UNKNOWN
U?#25 = REG_SWR_PTN78020WAH: REG - DC DC CONVERTER 2.5-12.6V 6A - TH; Manufacturer #1: Texas Instruments; Value: 7V ~ 36V -> 2.5 ~ 12.6V; Voltage Rating: 36V; Power Max: 90 W; GRAMS Lib Spec: 2.8; Magnetic Material: Yes; Cryo: UNKNOWN; Tolerance: -; Current Rating: 6A; HelpURL: http://www.ti.com/lit/ds/symlink/ptn78020h.pdf; CreatedBy/Date: Arnaud_Samson_2019-07-09; VerifiedBy: c.Paulin - 15 juillet 2019; Temperature: -40°C ~ 85°C; Package: TH; Manufacturer #2: -; Assembly Type: TH; Part Number #2: -; Part Number #1: PTN78020WAH; Polarized: Yes; Supplier 1: Digi-Key; Supplier Part Number 1: 296-20515-ND
U?#27 U?#28 = REG_LDO_TPS7A4701RGWR: REG - LINEAR POS ADJ 1A - 20VQFN; Manufacturer #1: Texas Instruments; GRAMS Lib Spec: 2.8; Magnetic Material: Unknown; Polarized: Yes; Value: 1.4 à 34V; Voltage rating: 35V max; Assembly Type: SMD; CreatedBy/Date: L-P Gauthier / 2018-05-29; Current Rating: 1A; Manufacturer #2: TBD; Part Number #1: TPS7A4701RGWR; Part Number #2: TBD; Package: 20-VQFN Exposed Pad; Power Max: *; Tolerance: -; Supplier 1: Digi-Key; Supplier Part Number 1: 296-37224-1-ND; VerifiedBy: Caroline Paulin - 28 sept 2018; Temperature: -40°C ~ 125°C; HelpURL: http://www.ti.com/lit/ds/symlink/tps7a47.pdf; Cryo: UNKNOWN
R?#91-R?#93 = RES - 0603: Current: *; CreatedBy: Jonathan Bouchard

## Sheet APP_1_FlashSPI.SchDoc
size Tabloid; SheetNumber: 10; SheetTotal: 13; Sheet_Name: Flash SPI; Size: 11x17
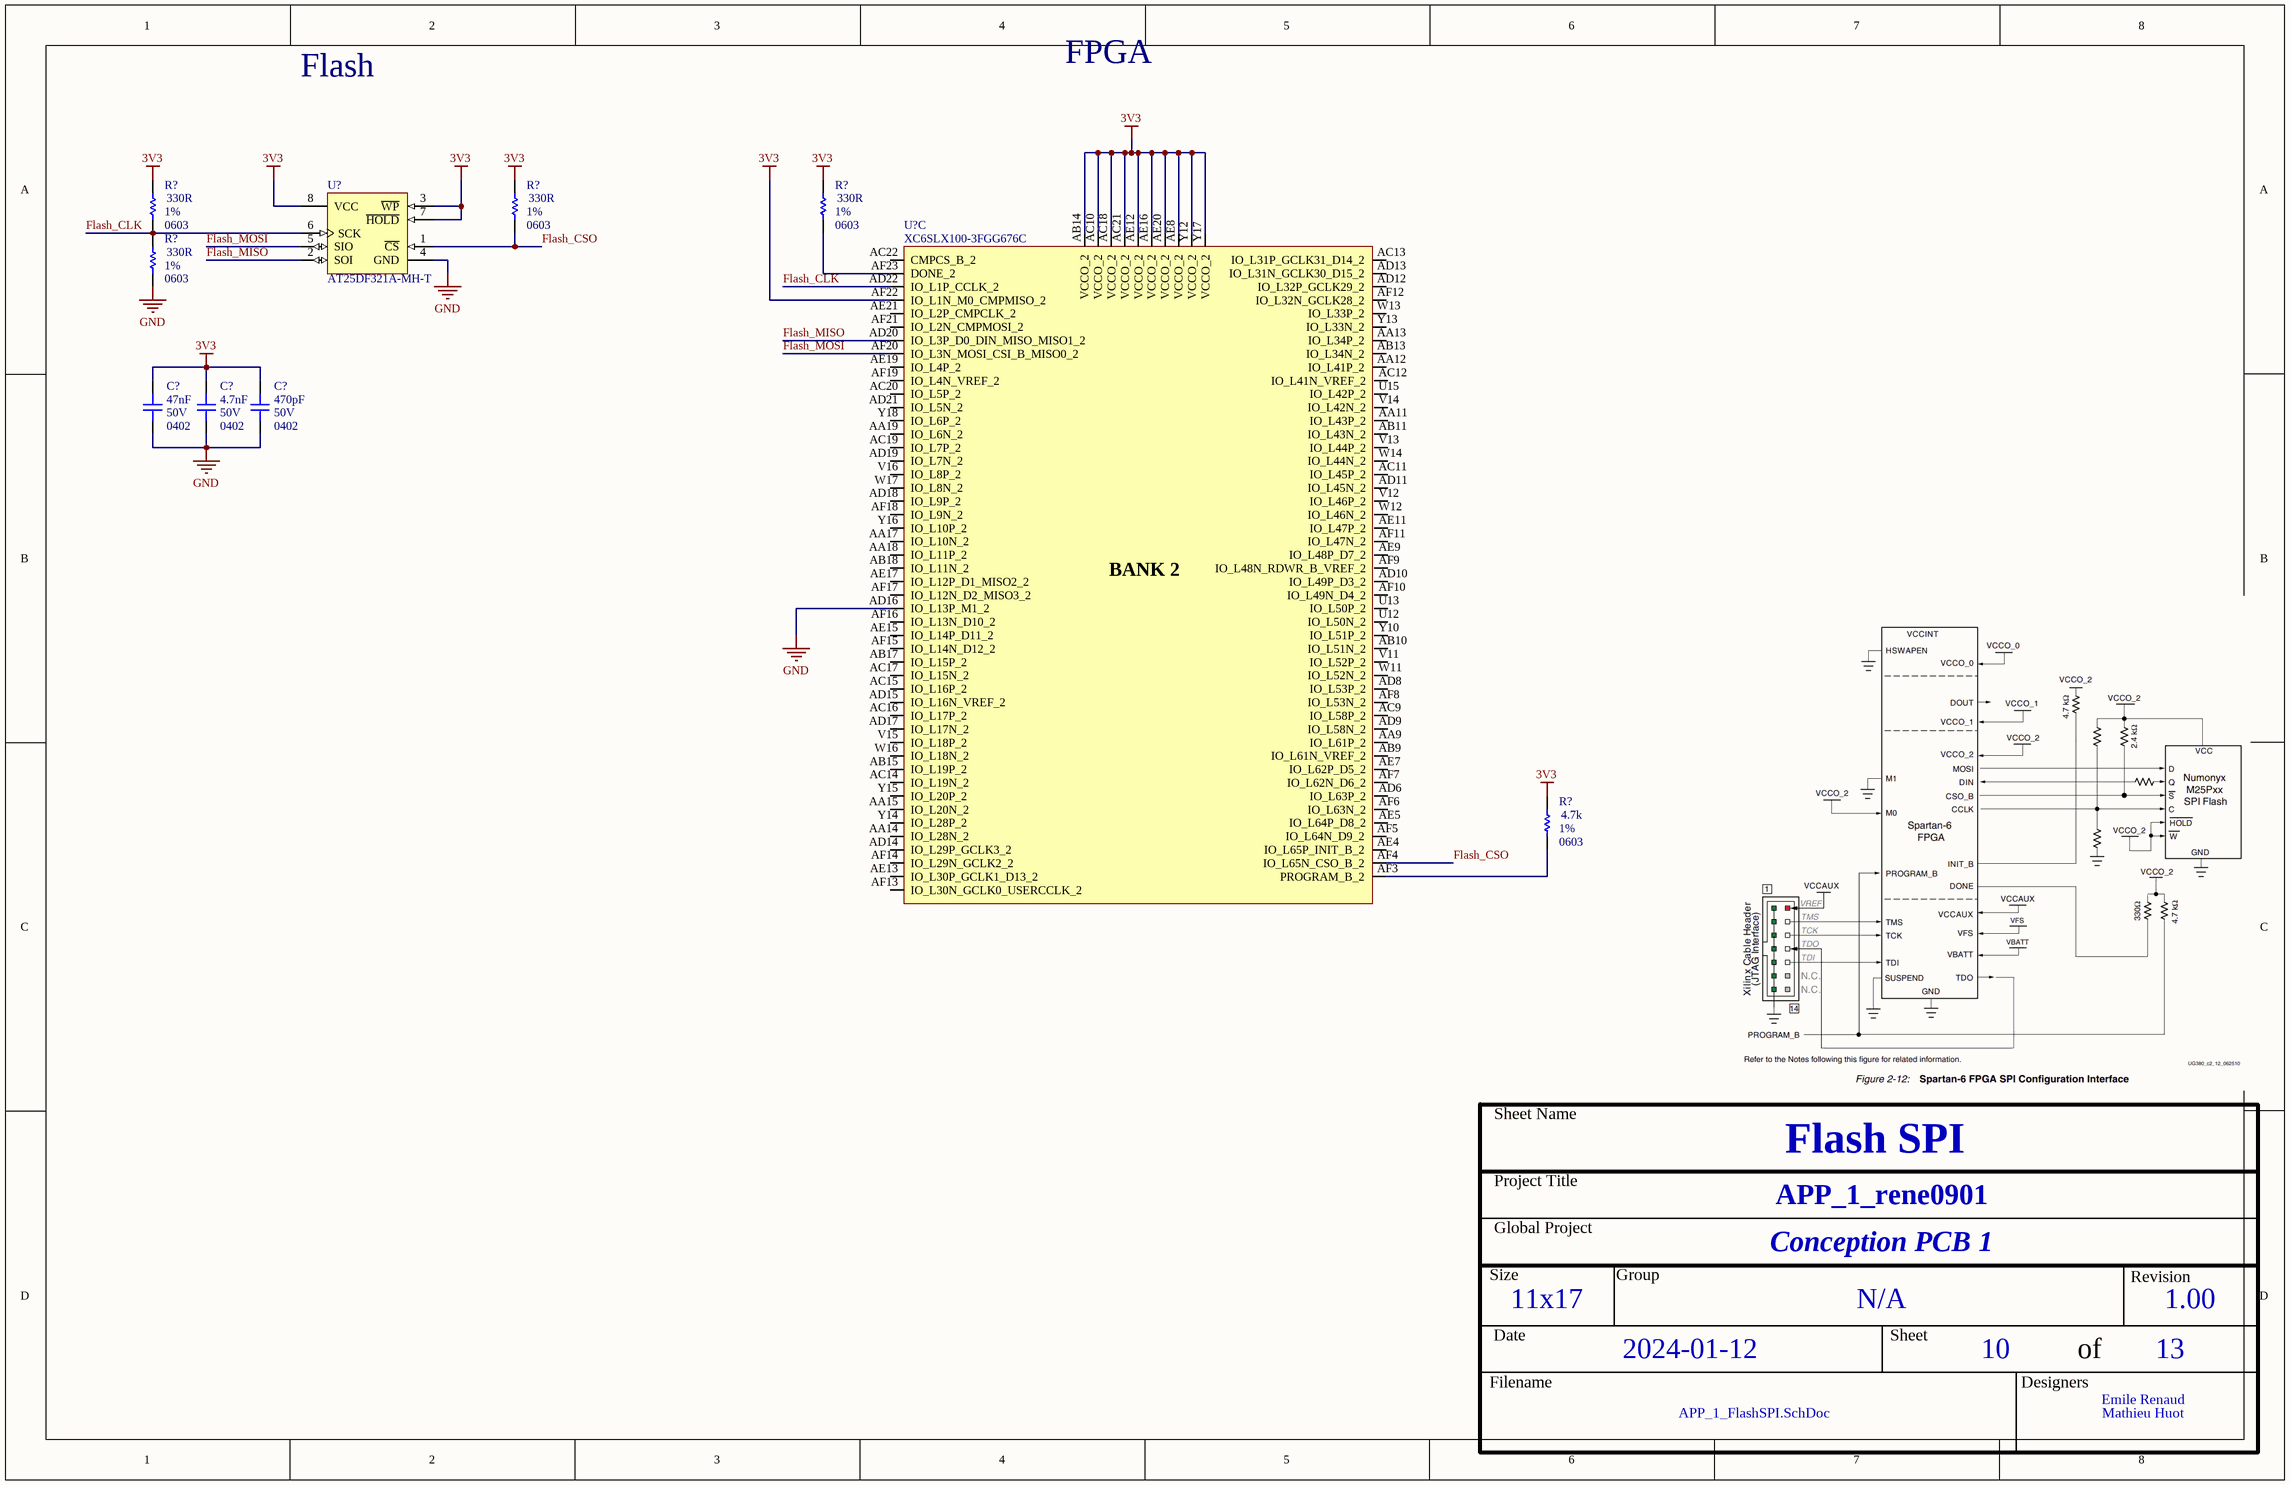
[diagram p10: APP_1_FlashSPI.SchDoc]

### Parts
(Parts that share a designator on the sheet are numbered #1, #2 ... from top to bottom, then left to right.)
C?#89  value 47nF  Voltage: 50V  Package: 0402  [CAP_0402]  (hidden comment: CAP - 0402)
C?#90  value 4.7nF  Voltage: 50V  Package: 0402  [CAP_0402]  (hidden comment: CAP - 0402)
C?#91  value 470pF  Voltage: 50V  Package: 0402  [CAP_0402]  (hidden comment: CAP - 0402)
R?#94  value 330R  Package: 0603  Precision: 1%  [RES_0603]  (hidden comment: RES - 0603)
R?#95  value 330R  Package: 0603  Precision: 1%  [RES_0603]  (hidden comment: RES - 0603)
R?#96  value 330R  Package: 0603  Precision: 1%  [RES_0603]  (hidden comment: RES - 0603)
R?#97  value 330R  Package: 0603  Precision: 1%  [RES_0603]  (hidden comment: RES - 0603)
R?#98  value 4.7k  Package: 0603  Precision: 1%  [RES_0603]  (hidden comment: RES - 0603)
U?#29  AT25DF321A-MH-T  [ADST-MA1-8_L]
U?#30  XC6SLX100-3FGG676C  [FPGA_XILINX_FGG676]  (part C of 10)

### Nets
3V3: C?#89.2 C?#90.2 C?#91.2 R?#94.2 R?#95.2 R?#96.2 R?#98.2 U?#29.3(~{WP}) U?#29.7(~{HOLD}) U?#29.8(VCC) U?#30.AB14(VCCO_2) U?#30.AC10(VCCO_2) U?#30.AC18(VCCO_2) U?#30.AC21(VCCO_2) U?#30.AE8(VCCO_2) U?#30.AE12(VCCO_2) U?#30.AE16(VCCO_2) U?#30.AE20(VCCO_2) U?#30.AF22(IO_L1N_M0_CMPMISO_2) U?#30.Y12(VCCO_2) U?#30.Y17(VCCO_2)
GND: C?#89.1 C?#90.1 C?#91.1 R?#97.1 U?#29.4(GND) U?#30.AD16(IO_L13P_M1_2)
Flash_CLK: R?#94.1 R?#97.2 U?#29.6(SCK) U?#30.AD22(IO_L1P_CCLK_2)
Flash_CSO: R?#95.1 U?#29.1(~{CS}) U?#30.AF4(IO_L65N_CSO_B_2)
Flash_MISO: U?#29.2(SOI) U?#30.AD20(IO_L3P_D0_DIN_MISO_MISO1_2)
Flash_MOSI: U?#29.5(SIO) U?#30.AF20(IO_L3N_MOSI_CSI_B_MISO0_2)
NetR?#96_1: R?#96.1 U?#30.AF23(DONE_2)
NetR?#98_1: R?#98.1 U?#30.AF3(PROGRAM_B_2)

Not connected (* = marked no-connect by the designer): U?#30 AA9(IO_L61P_2) AA11(IO_L43P_2) AA12(IO_L41P_2) AA13(IO_L34P_2) AA14(IO_L28N_2) AA15(IO_L20N_2) AA17(IO_L10N_2) AA18(IO_L11P_2) AA19(IO_L6N_2) AB9(IO_L61N_VREF_2) AB10(IO_L51N_2) AB11(IO_L43N_2) AB13(IO_L34N_2) AB15(IO_L19P_2) AB17(IO_L15P_2) AB18(IO_L11N_2) AC9(IO_L58P_2) AC11(IO_L45P_2) AC12(IO_L41N_VREF_2) AC13(IO_L31P_GCLK31_D14_2) AC14(IO_L19N_2) AC15(IO_L16P_2) AC16(IO_L17P_2) AC17(IO_L15N_2) AC19(IO_L7P_2) AC20(IO_L5P_2) AC22(CMPCS_B_2) AD6(IO_L63P_2) AD8(IO_L53P_2) AD9(IO_L58N_2) AD10(IO_L49P_D3_2) AD11(IO_L45N_2) AD12(IO_L32P_GCLK29_2) AD13(IO_L31N_GCLK30_D15_2) AD14(IO_L29P_GCLK3_2) AD15(IO_L16N_VREF_2) AD17(IO_L17N_2) AD18(IO_L9P_2) AD19(IO_L7N_2) AD21(IO_L5N_2) AE4(IO_L65P_INIT_B_2) AE5(IO_L64P_D8_2) AE7(IO_L62P_D5_2) AE9(IO_L48P_D7_2) AE11(IO_L47P_2) AE13(IO_L30P_GCLK1_D13_2) AE15(IO_L14P_D11_2) AE17(IO_L12P_D1_MISO2_2) AE19(IO_L4P_2) AE21(IO_L2P_CMPCLK_2) AF5(IO_L64N_D9_2) AF6(IO_L63N_2) AF7(IO_L62N_D6_2) AF8(IO_L53N_2) AF9(IO_L48N_RDWR_B_VREF_2) AF10(IO_L49N_D4_2) AF11(IO_L47N_2) AF12(IO_L32N_GCLK28_2) AF13(IO_L30N_GCLK0_USERCCLK_2) AF14(IO_L29N_GCLK2_2) AF15(IO_L14N_D12_2) AF16(IO_L13N_D10_2) AF17(IO_L12N_D2_MISO3_2) AF18(IO_L9N_2) AF19(IO_L4N_VREF_2) AF21(IO_L2N_CMPMOSI_2) U12(IO_L50N_2) U13(IO_L50P_2) U15(IO_L42P_2) V11(IO_L52P_2) V12(IO_L46P_2) V13(IO_L44P_2) V14(IO_L42N_2) V15(IO_L18P_2) V16(IO_L8P_2) W11(IO_L52N_2) W12(IO_L46N_2) W13(IO_L33P_2) W14(IO_L44N_2) W16(IO_L18N_2) W17(IO_L8N_2) Y10(IO_L51P_2) Y13(IO_L33N_2) Y14(IO_L28P_2) Y15(IO_L20P_2) Y16(IO_L10P_2) Y18(IO_L6P_2)

### Notes on the sheet
- Flash
- FPGA
- Sheet Name
- Project Title
- Global Project
- Size
- Group
- Revision
- Date
- Sheet
- of
- Filename
- Designers
- (in symbol FPGA_XC6SLX100-3FGG676C, part C) BANK 2

### Library data of the parts
C?#89-C?#91 = CAP - 0402: Precision: 10%; Current: *; CreatedBy: Jonathan Bouchard
  C?#89 C?#90: Power: *
U?#29 = FLA_AT25DF321A-MH-T: SPI Serial Flash Memory, 32 Megabit, 100 MHz, 2.7 to 3.6 V, -40 to 85 degC, 8-Pin UDFN (MA1-8), RoHS, Tape and Reel; Manufacturer: Adesto; Max. Freq: 100 MHz; Packing: Tape and Reel; PackageVersion: Rev. D; PartNumber: AT25DF321A-MH-T; RoHS: TRUE; PackageReference: MA1-8; ComponentLink2Description: Datasheet; Device Density: 32 Megabit; PackageDescription: 8-Pin Thermally Enhanced Plastic Ultra Thin Dual Flat No Lead Package, Body 5 x 6 mm, Pitch 1.27 mm; ComponentLink2URL: http://www.adestotech.com/sites/default/files/datasheets/doc3686.pdf; DatasheetVersion: Rev. 3686E; Mounting Technology: Surface Mount; ComponentLink1URL: http://www.adestotech.com/; ComponentLink1Description: Manufacturer URL; Interface: Serial; ComponentLink3Description: Package Specification; Operating Temperature: -40 to 85 degC; Operating Voltage: 2.7 to 3.6 V; ComponentLink3URL: http://www.adestotech.com/sites/default/files/datasheets/doc3668.pdf
U?#30 = FPGA_XC6SLX100-3FGG676C: FPGA - XILINX SPARTAN 6 480 I/O - BGA-676; Voltage: 1.14 V ~ 1.26 V; Current: *; Power: *; Mfg: Xilinx; Mfg Part Number: XC6SLX100-3FGG676C; HelpURL: https://www.xilinx.com/support/documentation/data_sheets/ds162.pdf; CreatedBy: Jonathan Bouchard; Temperature: 0°C ~ 85°C (TJ); Value: *; Precision: *; Package: BGA-676; Supplier 1: Digikey; Supplier Part Number 1: 122-1760-ND
R?#94-R?#98 = RES - 0603: Current: *; CreatedBy: Jonathan Bouchard

## Sheet APP_1_PLL.SchDoc
size Tabloid; SheetNumber: 13; SheetTotal: 13; Sheet_Name: PLL; Size: 11x17
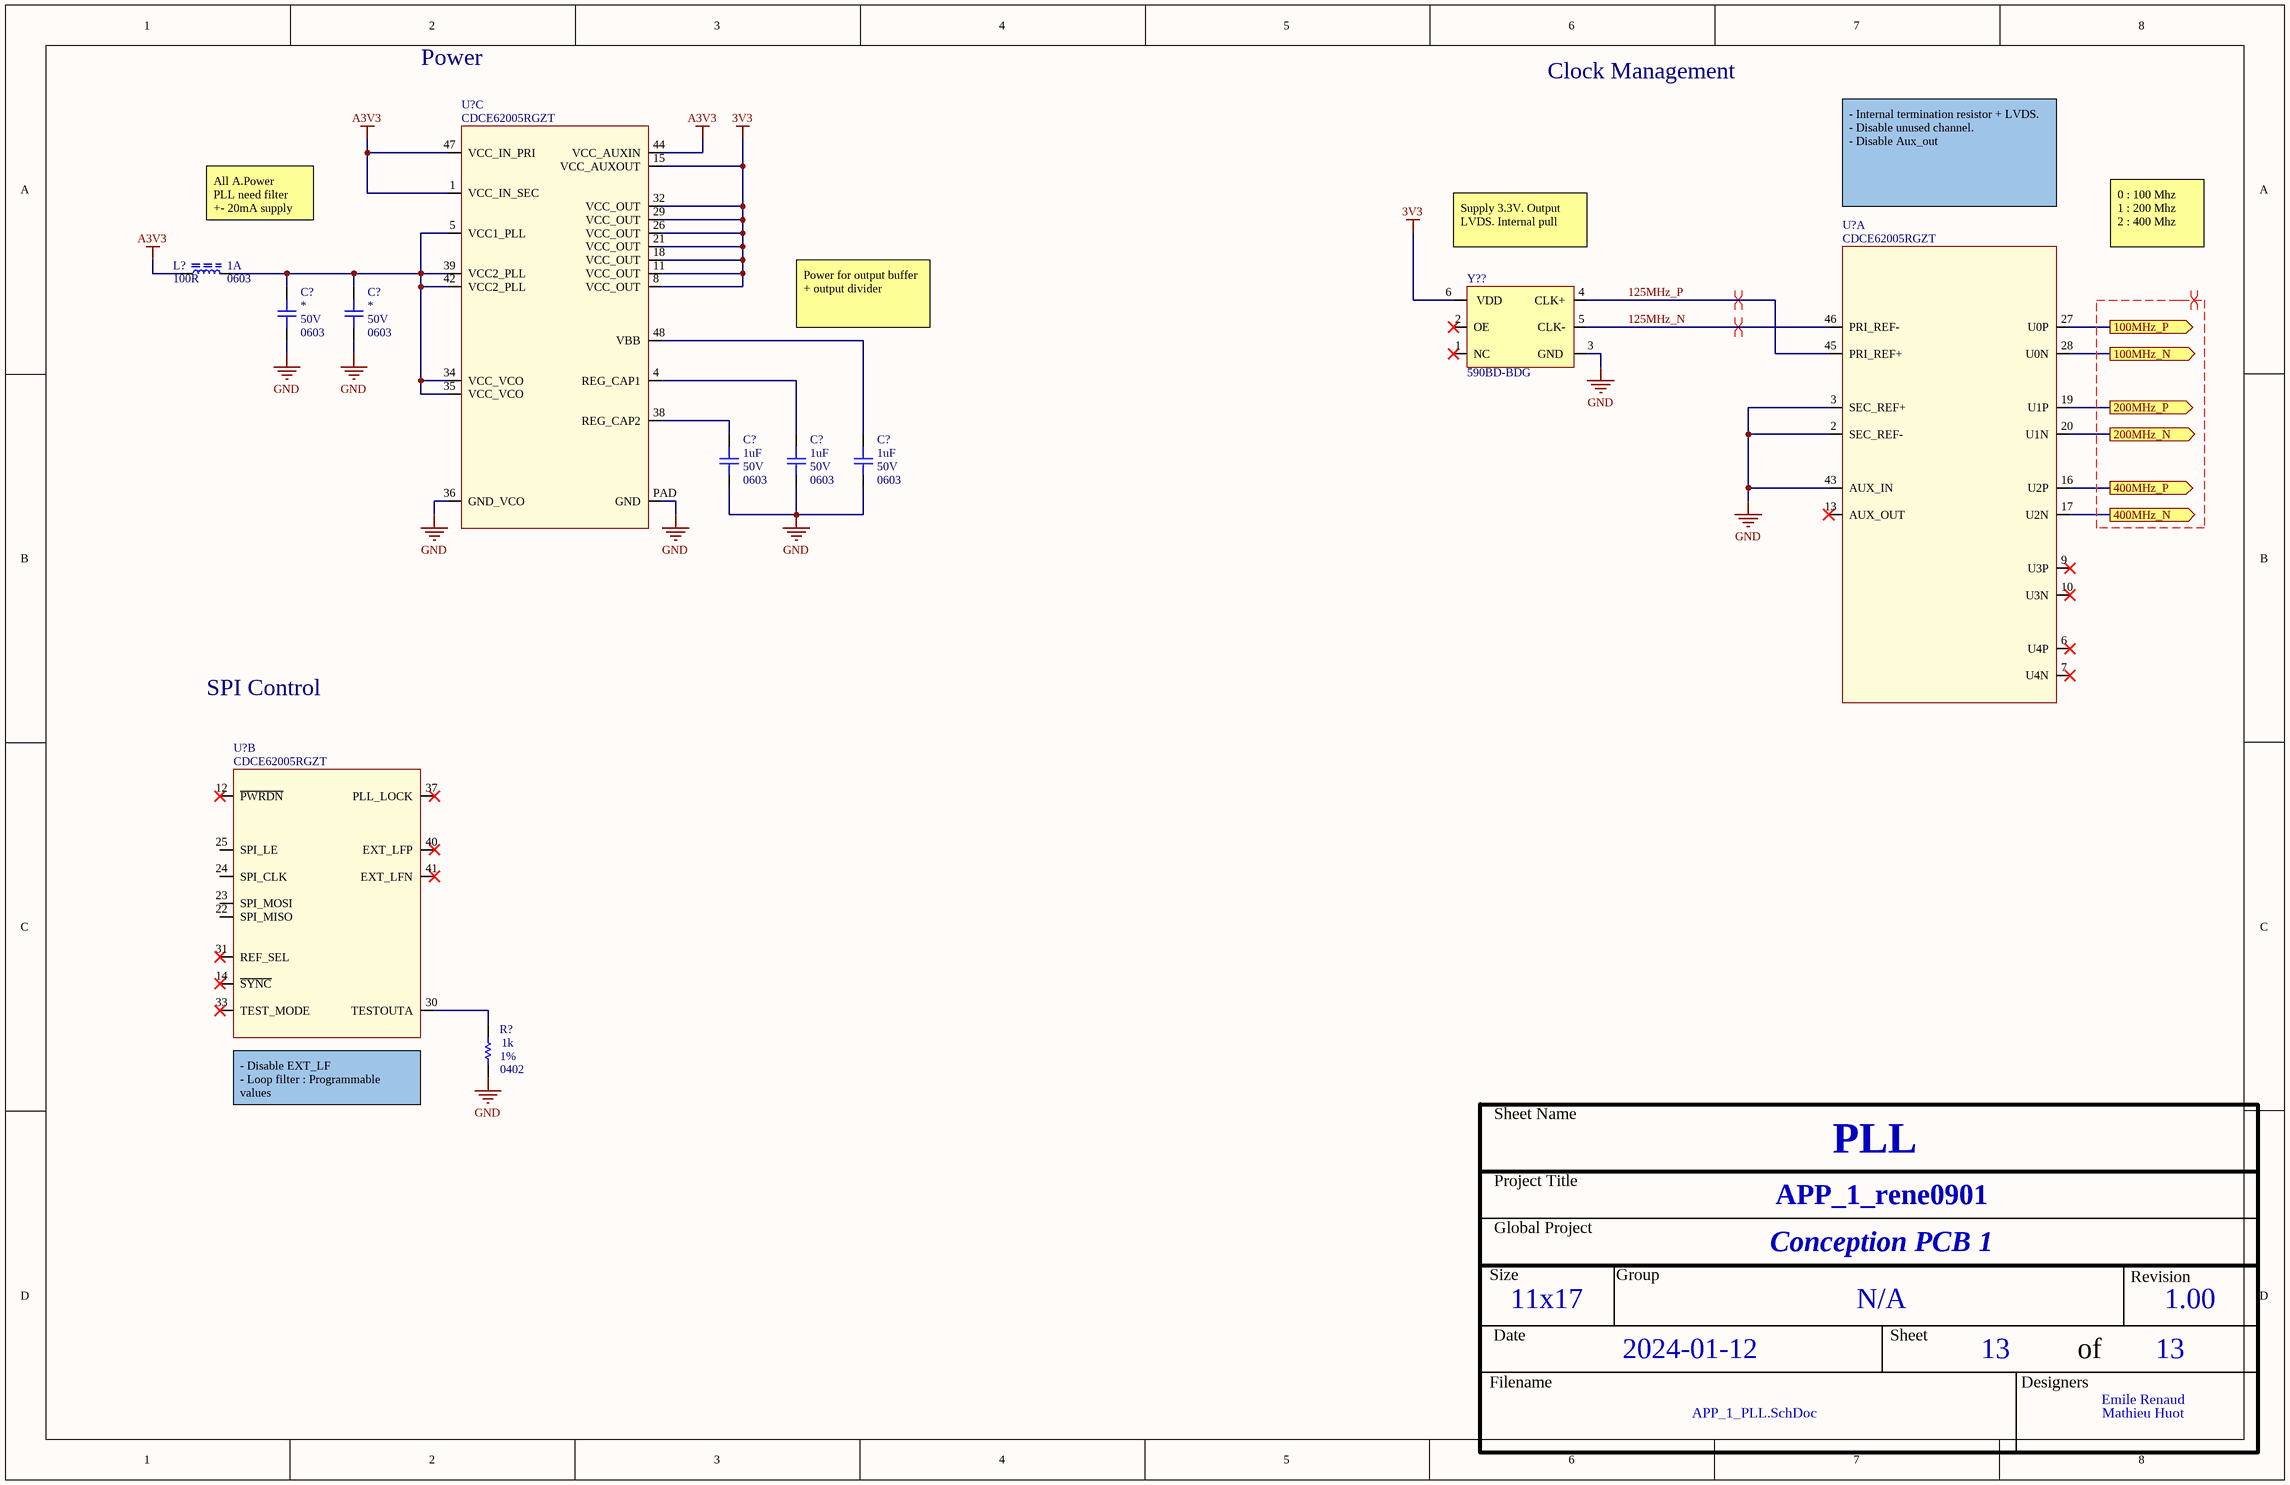
[diagram p11: APP_1_PLL.SchDoc]

### Parts
(Parts that share a designator on the sheet are numbered #1, #2 ... from top to bottom, then left to right.)
C?#92  Voltage: 50V  Package: 0603  [CAP_0603]  (hidden comment: CAP - 0603)
C?#93  Voltage: 50V  Package: 0603  [CAP_0603]  (hidden comment: CAP - 0603)
C?#94  value 1uF  Voltage: 50V  Package: 0603  [CAP_0603]  (hidden comment: CAP - 0603)
C?#95  value 1uF  Voltage: 50V  Package: 0603  [CAP_0603]  (hidden comment: CAP - 0603)
C?#96  value 1uF  Voltage: 50V  Package: 0603  [CAP_0603]  (hidden comment: CAP - 0603)
L?#11  value 100R  Current: 1A  Package: 0603  [FER_0603]  (hidden comment: FER - 0603)
R?#99  value 1k  Package: 0402  Precision: 1%  [RES_0402]  (hidden comment: RES - 0402)
U?#31  CDCE62005RGZT  [TIM_CDCE62005RGZT]  (part C of 3)
U?#32  CDCE62005RGZT  [TIM_CDCE62005RGZT]  (part A of 3)
U?#33  CDCE62005RGZT  [TIM_CDCE62005RGZT]  (part B of 3)
Y??#2  590BD-BDG  [OSC_590BD-BDG]

### Ports
100MHz_N (out), 100MHz_P (out), 200MHz_N (out), 200MHz_P (out), 400MHz_N (out), 400MHz_P (out)

### Nets
3V3: U?#31.8(VCC_OUT) U?#31.11(VCC_OUT) U?#31.15(VCC_AUXOUT) U?#31.18(VCC_OUT) U?#31.21(VCC_OUT) U?#31.26(VCC_OUT) U?#31.29(VCC_OUT) U?#31.32(VCC_OUT) Y??#2.6(VDD)
A3V3: L?#11.2 U?#31.1(VCC_IN_SEC) U?#31.44(VCC_AUXIN) U?#31.47(VCC_IN_PRI)
GND: C?#92.1 C?#93.1 C?#94.1 C?#95.1 C?#96.1 R?#99.1 U?#31.36(GND_VCO) U?#31.PAD(GND) U?#32.2(SEC_REF-) U?#32.3(SEC_REF+) U?#32.43(AUX_IN) Y??#2.3(GND)
100MHz_N: U?#32.28(U0N) ; port 100MHz_N
100MHz_P: U?#32.27(U0P) ; port 100MHz_P
125MHz_N: U?#32.46(PRI_REF-) Y??#2.5(CLK-)
125MHz_P: U?#32.45(PRI_REF+) Y??#2.4(CLK+)
200MHz_N: U?#32.20(U1N) ; port 200MHz_N
200MHz_P: U?#32.19(U1P) ; port 200MHz_P
400MHz_N: U?#32.17(U2N) ; port 400MHz_N
400MHz_P: U?#32.16(U2P) ; port 400MHz_P
NetC?#92_2: C?#92.2 C?#93.2 L?#11.1 U?#31.5(VCC1_PLL) U?#31.34(VCC_VCO) U?#31.35(VCC_VCO) U?#31.39(VCC2_PLL) U?#31.42(VCC2_PLL)
NetC?#94_2: C?#94.2 U?#31.38(REG_CAP2)
NetC?#95_2: C?#95.2 U?#31.4(REG_CAP1)
NetC?#96_2: C?#96.2 U?#31.48(VBB)
NetR?#99_2: R?#99.2 U?#33.30(TESTOUTA)

Not connected (* = marked no-connect by the designer): U?#32 6(U4P)* 7(U4N)* 9(U3P)* 10(U3N)* 13(AUX_OUT)*; U?#33 12(~{PWRDN})* 14(~{SYNC})* 22(SPI_MISO) 23(SPI_MOSI) 24(SPI_CLK) 25(SPI_LE) 31(REF_SEL)* 33(TEST_MODE)* 37(PLL_LOCK)* 40(EXT_LFP)* 41(EXT_LFN)*; Y??#2 1(NC)* 2(OE)*

### Layout directives
differential pair: 125MHz_N, 125MHz_P, (no net found under the mark)

### Notes on the sheet
- Power
- Clock Management
- All A.Power
  PLL need filter
  +- 20mA supply
- - Internal termination resistor + LVDS.
  - Disable unused channel.
  - Disable Aux_out
- Supply 3.3V. Output LVDS. Internal pull
- 0 : 100 Mhz
  1 : 200 Mhz
  2 : 400 Mhz
- Power for output buffer + output divider
- SPI Control
- (near U?#33) - Disable EXT_LF
  - Loop filter : Programmable values
  - Can program PLL_Lock
- Sheet Name
- Project Title
- Global Project
- Size
- Group
- Revision
- Date
- Sheet
- of
- Filename
- Designers

### Library data of the parts
C?#92-C?#96 = CAP - 0603: Precision: 10%; Current: *; CreatedBy: Jonathan Bouchard; Power: *
  C?#92 C?#93: Value: *
R?#99 = RES - 0402: Voltage: 50V; Power: 1/16W; Current: *; CreatedBy: Jonathan Bouchard
U?#31-U?#33 = TIM_CDCE62005RGZT: TIM - CLK SYNTH JITTER CLEANER 3:5 - QFN-48; Voltage: 3 V ~ 3.6 V; Mfg: Texas Instruments; Current: *; Power: *; Mfg Part Number: CDCE62005RGZT; HelpURL: http://www.ti.com/lit/ds/symlink/cdce62005.pdf; CreatedBy: Jonathan Bouchard; Temperature: -40°C ~ 85°C; Value: *; Precision: *; Package: QFN-48; Supplier 1: Digikey; Supplier Part Number 1: 296-23947-1-ND
Y??#2 = OSC_590BD-BDG: TIM - OSC PROG 125MHz ~ 214.999MHz LVDS 3.3V 7PPM EN/DS - 6-SMD; Manufacturer #1: Silicon Labs; Current Rating: 100 mA (supply); Note: Spécifié la fréquence lors de la commande; Voltage rating: 3.3V (supply); Polarized: Yes; Value: ±7ppm (freq Stability), ±20ppm (freq stability total); Magnetic Material: UNKNOWN; GRAMS Lib Spec: 2.8; Manufacturer #2: *; Power Max: *; Part Number #1: 590BD-BDG; Part Number #2: *; HelpURL: https://www.silabs.com/documents/public/data-sheets/Si590-591.pdf; Supplier 1: Digi-Key; Supplier Part Number 1: 590BD-BDG-ND; Assembly Type: SMD; Temperature: -40°C ~ 85°C; Package: 6-SMD; CreatedBy/Date: from 590BD-CDG; Tolerance: *; VerifiedBy: Caroline Paulin / 3/10/2019; Cryo: UNKNOWN
L?#11 = FER - 0603: Voltage: *; CreatedBy: Jonathan Bouchard; Power: *; Precision: *

## Nets that join several sheets
1V8: APP_1_DAC (7 pins), APP_1_ADC (U?#21.1 U?#21.38 U?#21.48 U?#21.58), APP_1_Power (5 pins)
3V3: APP_1_Connectors_e (J?#2.10 J?#2.12), APP_1_FPGA_e (12 pins), APP_1_DDR3_e (16 pins), APP_1_Stepper (R?#38.2 R?#41.2 U?#9.10), APP_1_Ethernet (10 pins), APP_1_Power (11 pins), APP_1_FlashSPI (21 pins), APP_1_PLL (9 pins)
24V: APP_1_Connectors_e (D?#1.4 D??#1.4), APP_1_Stepper (C?#22.1 C?#24.2 U?#10.28 U?#11.15), APP_1_Power (C?#67.2 U?#25.2 U?#25.3)
+5: APP_1_DAC (U?#13.8), APP_1_ADC (6 pins)
A3V3: APP_1_DAC (7 pins), APP_1_ADC (U?#21.16 U?#21.33 U?#21.34), APP_1_Power (5 pins), APP_1_PLL (L?#11.2 U?#31.1 U?#31.44 U?#31.47)
GND: APP_1_Connectors_e (32 pins), APP_1_FPGA_e (71 pins), APP_1_DDR3_e (50 pins), APP_1_Prog (8 pins), APP_1_Stepper (14 pins), APP_1_DAC (23 pins), APP_1_ADC (18 pins), APP_1_Ethernet (21 pins), APP_1_Power (53 pins), APP_1_FlashSPI (6 pins), APP_1_PLL (12 pins)
USB: APP_1_Connectors_e (8 pins), APP_1_Prog (ISO?.2 ISO?.8)
USB_5V: APP_1_Connectors_e (D??#2.1 J??#1.1), APP_1_Prog (ISO?.1 ISO?.3 ISO?.4 ISO?.5)
ADC_IN_1: APP_1_Connectors_e (D??#4.1 J?#5.1), APP_1_ADC (R?#63.2 R?#65.2)
ADC_IN_2: APP_1_Connectors_e (D?#7.1 J?#6.1), APP_1_ADC (R?#70.2 R?#72.2)
DAC_OUT1: APP_1_Connectors_e (D?#5.1 J?#3.1), APP_1_DAC (R?#48.1)
DAC_OUT2: APP_1_Connectors_e (D?#6.1 J?#4.1), APP_1_DAC (R?#55.1)
DDR3_BA0: APP_1_FPGA_e (U?#1.P3), APP_1_DDR3_e (R?#26.1 U?#7.M2)
DDR3_BA1: APP_1_FPGA_e (U?#1.P1), APP_1_DDR3_e (R?#27.1 U?#7.N8)
DDR3_BA2: APP_1_FPGA_e (U?#1.N5), APP_1_DDR3_e (R?#28.1 U?#7.M3)
DDR3_CAS_N: APP_1_FPGA_e (U?#1.P8), APP_1_DDR3_e (R?#32.1 U?#7.K3)
DDR3_CK_N: APP_1_FPGA_e (U?#1.R3), APP_1_DDR3_e (R?#30.1 U?#7.K7)
DDR3_CK_P: APP_1_FPGA_e (U?#1.R4), APP_1_DDR3_e (R?#29.2 U?#7.J7)
DDR3_ODT: APP_1_FPGA_e (U?#1.P6), APP_1_DDR3_e (R?#34.1 U?#7.K1)
DDR3_RAS_N: APP_1_FPGA_e (U?#1.N8), APP_1_DDR3_e (R?#31.1 U?#7.J3)
DDR3_UDM: APP_1_FPGA_e (U?#1.V4), APP_1_DDR3_e (U?#7.D3)
DDR3_UDQS_N: APP_1_FPGA_e (U?#1.AC1), APP_1_DDR3_e (U?#7.B7)
DDR3_UDQS_P: APP_1_FPGA_e (U?#1.AC2), APP_1_DDR3_e (U?#7.C7)
DDR3_WE_N: APP_1_FPGA_e (U?#1.P5), APP_1_DDR3_e (R?#33.1 U?#7.L3)
ETH_LED_1: APP_1_Connectors_e (J?#2.9), APP_1_Ethernet (R?#88.1)
ETH_RD_N: APP_1_Connectors_e (T?.8), APP_1_Ethernet (U?#23.4)
ETH_RD_P: APP_1_Connectors_e (T?.6), APP_1_Ethernet (U?#23.5)
ETH_TD_N: APP_1_Connectors_e (R?#1.2 T?.3), APP_1_Ethernet (U?#23.6)
ETH_TD_P: APP_1_Connectors_e (R?#1.1 T?.1), APP_1_Ethernet (U?#23.7)
Motor_AOUT1: APP_1_Connectors_e (D?#4.1 J?#1.1), APP_1_Stepper (U?#10.4)
Motor_AOUT2: APP_1_Connectors_e (D?#3.1 J?#1.2), APP_1_Stepper (U?#10.25)
Motor_BOUT1: APP_1_Connectors_e (D?#2.1 J?#1.3), APP_1_Stepper (U?#11.11)
Motor_BOUT2: APP_1_Connectors_e (D??#3.1 J?#1.4), APP_1_Stepper (U?#11.18)
USB_N: APP_1_Connectors_e (D??#2.3 J??#1.2), APP_1_Prog (ISO?.6)
USB_P: APP_1_Connectors_e (D??#2.5 J??#1.3), APP_1_Prog (ISO?.7)